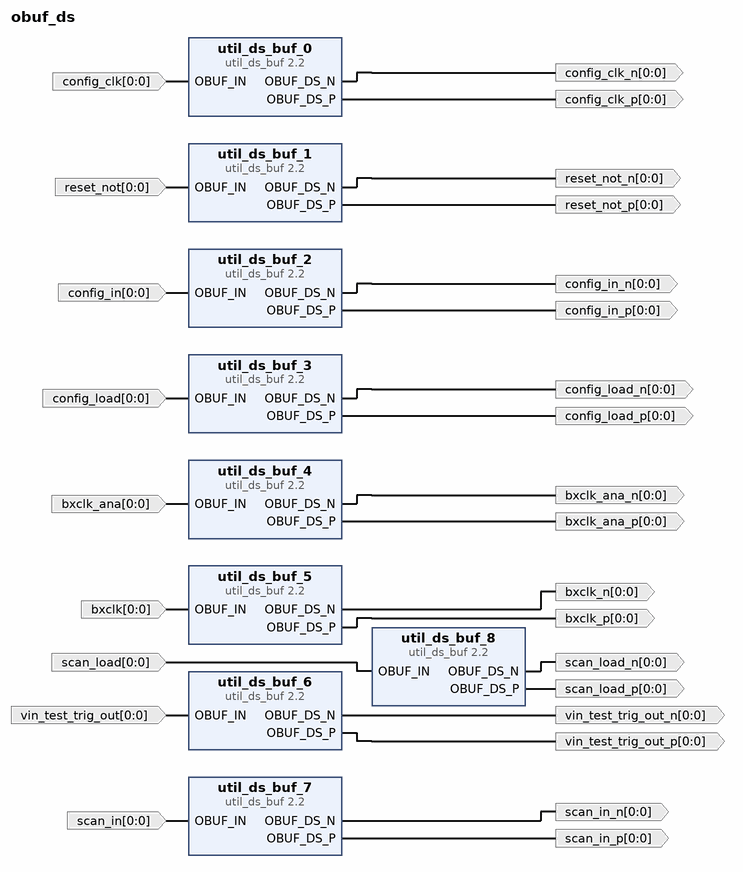
[diagram p0: block diagram of the top level]
# Vivado block design obuf_ds, xczu9eg-ffvb1156-2-e, Vivado 2022.1
create_bd_design obuf_ds

create_bd_port -dir I -from 0 -to 0 -type data config_clk
create_bd_port -dir O -from 0 -to 0 -type data config_clk_p
create_bd_port -dir O -from 0 -to 0 -type data config_clk_n
create_bd_port -dir I -from 0 -to 0 -type data config_in
create_bd_port -dir O -from 0 -to 0 -type data config_in_p
create_bd_port -dir O -from 0 -to 0 -type data config_in_n
create_bd_port -dir I -from 0 -to 0 -type data config_load
create_bd_port -dir O -from 0 -to 0 -type data config_load_p
create_bd_port -dir O -from 0 -to 0 -type data config_load_n
create_bd_port -dir O -from 0 -to 0 -type data bxclk_ana_p
create_bd_port -dir O -from 0 -to 0 -type data bxclk_ana_n
create_bd_port -dir I -from 0 -to 0 -type data bxclk_ana
create_bd_port -dir I -from 0 -to 0 -type data bxclk
create_bd_port -dir O -from 0 -to 0 -type data bxclk_p
create_bd_port -dir O -from 0 -to 0 -type data bxclk_n
create_bd_port -dir I -from 0 -to 0 -type data vin_test_trig_out
create_bd_port -dir O -from 0 -to 0 -type data vin_test_trig_out_p
create_bd_port -dir O -from 0 -to 0 -type data vin_test_trig_out_n
create_bd_port -dir O -from 0 -to 0 -type data scan_in_p
create_bd_port -dir O -from 0 -to 0 -type data scan_in_n
create_bd_port -dir I -from 0 -to 0 -type data scan_in
create_bd_port -dir I -from 0 -to 0 -type data scan_load
create_bd_port -dir O -from 0 -to 0 -type data scan_load_p
create_bd_port -dir O -from 0 -to 0 -type data scan_load_n
create_bd_port -dir O -from 0 -to 0 -type data reset_not_p
create_bd_port -dir O -from 0 -to 0 -type data reset_not_n
create_bd_port -dir I -from 0 -to 0 -type data reset_not

create_bd_cell -type ip -vlnv xilinx.com:ip:util_ds_buf:2.2 util_ds_buf_0
set_property -dict {CONFIG.C_BUF_TYPE OBUFDS} [get_bd_cells util_ds_buf_0]
create_bd_cell -type ip -vlnv xilinx.com:ip:util_ds_buf:2.2 util_ds_buf_2
set_property -dict {CONFIG.C_BUF_TYPE OBUFDS} [get_bd_cells util_ds_buf_2]
create_bd_cell -type ip -vlnv xilinx.com:ip:util_ds_buf:2.2 util_ds_buf_3
set_property -dict {CONFIG.C_BUF_TYPE OBUFDS} [get_bd_cells util_ds_buf_3]
create_bd_cell -type ip -vlnv xilinx.com:ip:util_ds_buf:2.2 util_ds_buf_4
set_property -dict {CONFIG.C_BUF_TYPE OBUFDS} [get_bd_cells util_ds_buf_4]
create_bd_cell -type ip -vlnv xilinx.com:ip:util_ds_buf:2.2 util_ds_buf_5
set_property -dict {CONFIG.C_BUF_TYPE OBUFDS} [get_bd_cells util_ds_buf_5]
create_bd_cell -type ip -vlnv xilinx.com:ip:util_ds_buf:2.2 util_ds_buf_6
set_property -dict {CONFIG.C_BUF_TYPE OBUFDS} [get_bd_cells util_ds_buf_6]
create_bd_cell -type ip -vlnv xilinx.com:ip:util_ds_buf:2.2 util_ds_buf_7
set_property -dict {CONFIG.C_BUF_TYPE OBUFDS} [get_bd_cells util_ds_buf_7]
create_bd_cell -type ip -vlnv xilinx.com:ip:util_ds_buf:2.2 util_ds_buf_8
set_property -dict {CONFIG.C_BUF_TYPE OBUFDS} [get_bd_cells util_ds_buf_8]
create_bd_cell -type ip -vlnv xilinx.com:ip:util_ds_buf:2.2 util_ds_buf_1
set_property -dict {CONFIG.C_BUF_TYPE OBUFDS} [get_bd_cells util_ds_buf_1]

# ---- connections ----

connect_bd_net [get_bd_ports bxclk] [get_bd_pins util_ds_buf_5/OBUF_IN]
connect_bd_net [get_bd_ports bxclk_ana] [get_bd_pins util_ds_buf_4/OBUF_IN]
connect_bd_net [get_bd_ports config_clk] [get_bd_pins util_ds_buf_0/OBUF_IN]
connect_bd_net [get_bd_ports config_in] [get_bd_pins util_ds_buf_2/OBUF_IN]
connect_bd_net [get_bd_ports config_load] [get_bd_pins util_ds_buf_3/OBUF_IN]
connect_bd_net [get_bd_ports reset_not] [get_bd_pins util_ds_buf_1/OBUF_IN]
connect_bd_net [get_bd_ports scan_in] [get_bd_pins util_ds_buf_7/OBUF_IN]
connect_bd_net [get_bd_ports scan_load] [get_bd_pins util_ds_buf_8/OBUF_IN]
connect_bd_net [get_bd_pins util_ds_buf_0/OBUF_DS_N] [get_bd_ports config_clk_n]
connect_bd_net [get_bd_pins util_ds_buf_0/OBUF_DS_P] [get_bd_ports config_clk_p]
connect_bd_net [get_bd_pins util_ds_buf_1/OBUF_DS_N] [get_bd_ports reset_not_n]
connect_bd_net [get_bd_pins util_ds_buf_1/OBUF_DS_P] [get_bd_ports reset_not_p]
connect_bd_net [get_bd_pins util_ds_buf_2/OBUF_DS_N] [get_bd_ports config_in_n]
connect_bd_net [get_bd_pins util_ds_buf_2/OBUF_DS_P] [get_bd_ports config_in_p]
connect_bd_net [get_bd_pins util_ds_buf_3/OBUF_DS_N] [get_bd_ports config_load_n]
connect_bd_net [get_bd_pins util_ds_buf_3/OBUF_DS_P] [get_bd_ports config_load_p]
connect_bd_net [get_bd_pins util_ds_buf_4/OBUF_DS_N] [get_bd_ports bxclk_ana_n]
connect_bd_net [get_bd_pins util_ds_buf_4/OBUF_DS_P] [get_bd_ports bxclk_ana_p]
connect_bd_net [get_bd_pins util_ds_buf_5/OBUF_DS_N] [get_bd_ports bxclk_n]
connect_bd_net [get_bd_pins util_ds_buf_5/OBUF_DS_P] [get_bd_ports bxclk_p]
connect_bd_net [get_bd_pins util_ds_buf_6/OBUF_DS_N] [get_bd_ports vin_test_trig_out_n]
connect_bd_net [get_bd_pins util_ds_buf_6/OBUF_DS_P] [get_bd_ports vin_test_trig_out_p]
connect_bd_net [get_bd_pins util_ds_buf_7/OBUF_DS_N] [get_bd_ports scan_in_n]
connect_bd_net [get_bd_pins util_ds_buf_7/OBUF_DS_P] [get_bd_ports scan_in_p]
connect_bd_net [get_bd_pins util_ds_buf_8/OBUF_DS_N] [get_bd_ports scan_load_n]
connect_bd_net [get_bd_pins util_ds_buf_8/OBUF_DS_P] [get_bd_ports scan_load_p]
connect_bd_net [get_bd_ports vin_test_trig_out] [get_bd_pins util_ds_buf_6/OBUF_IN]

validate_bd_design
save_bd_design
